# Altium project 111.PrjPCB
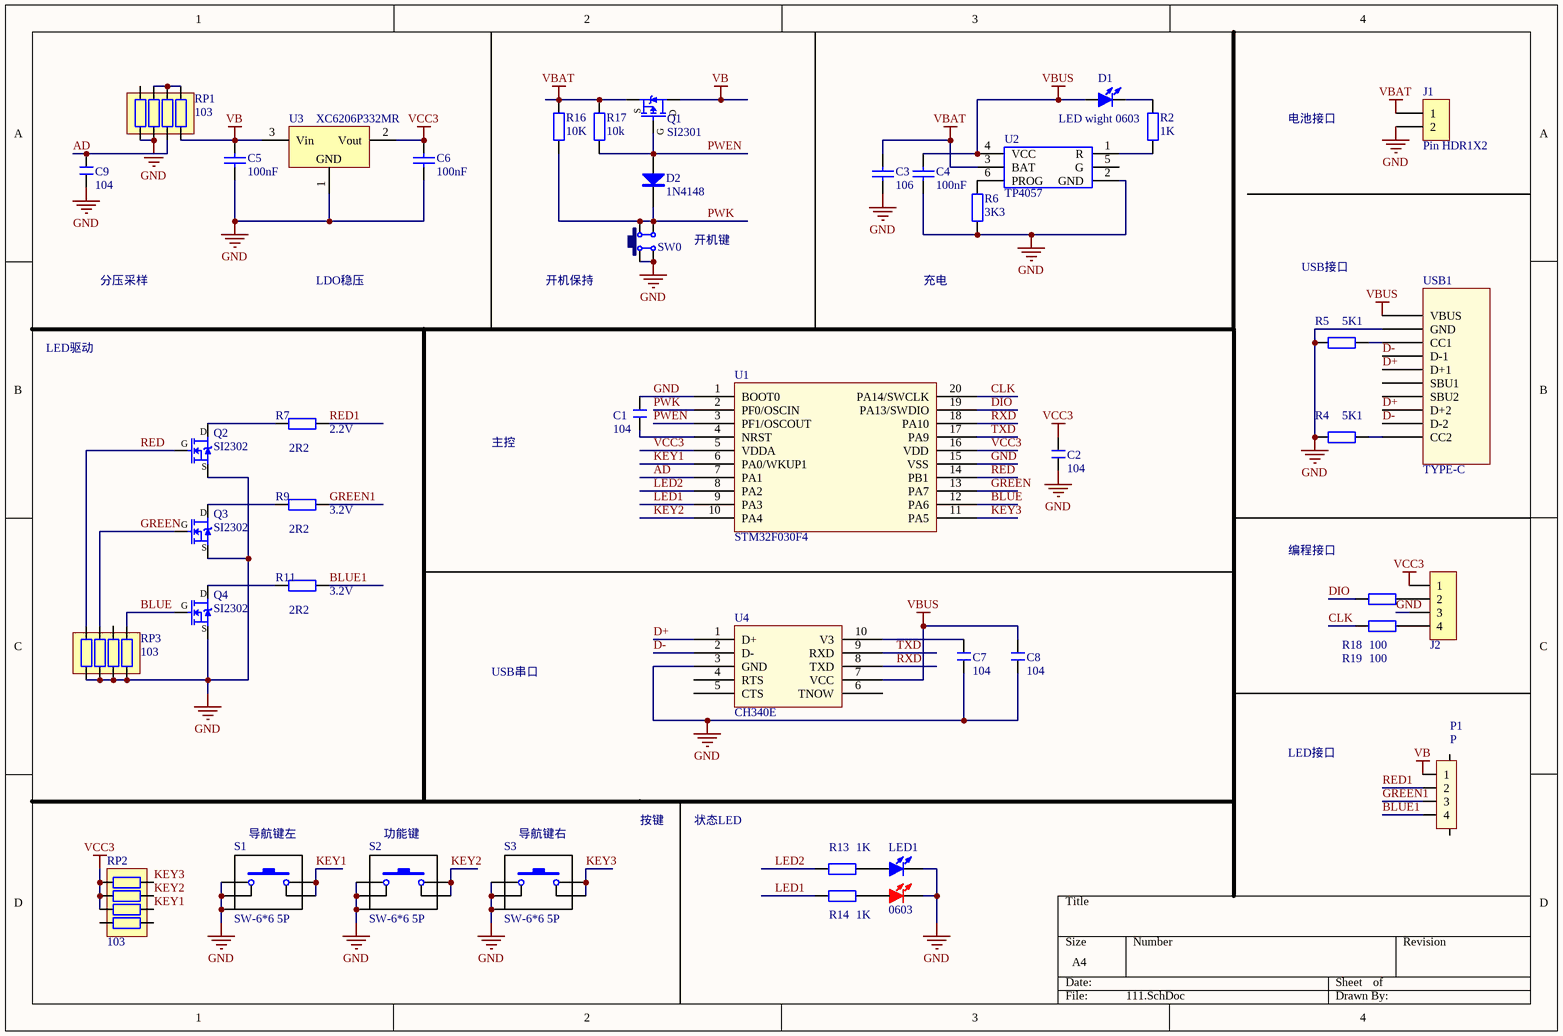
[diagram p0: 111.SchDoc]
1 sheet, 44 parts. Net scope: global (net labels, ports and power ports of the same name join across sheets).
Board file: 111.PcbDoc

## Sheet 111.SchDoc
size A4

### Parts
C1  104  [C 0402_M]
C2  104  [C 0402_M]
C3  value 106  [C-RAD-0805]  (hidden comment: Cap)
C4  value 100nF  [C-RAD-0603]  (hidden comment: Cap)
C5  value 100nF  [C-RAD-0603]  (hidden comment: Cap)
C6  value 100nF  [C-RAD-0603]  (hidden comment: Cap)
C7  104  [C 0402_M]
C8  104  [C 0402_M]
C9  104  [C 0402_M]
D1  LED wight 0603  [LED 0603R]
D2  1N4148  [SOD-323]
J1  Pin HDR1X2  [SH1.0_2pin]
J2  HDR-1X4  [HDR2.0-LI-4P]  (value not drawn)
LED1  0603  [LED 0603-RG]
P1  P  [SH1.0_4pin]
Q1  SI2301  [SOT23-3N]
Q2  SI2302  [SOT23-3N]
Q3  SI2302  [SOT23-3N]
Q4  SI2302  [SOT23-3N]
R2  1K  [R 0402_M]
R4  5K1  [R 0402_M]
R5  5K1  [R 0402_M]
R6  3K3  [R 0402_M]
R7  2R2  [0603-1]
R9  2R2  [0603-1]
R11  2R2  [0603-1]
R13  1K  [R 0402_M]
R14  1K  [R 0402_M]
R16  10K  [R 0402_M]
R17  10k  [R 0402_M]
R18  100  [R 0402_M]
R19  100  [R 0402_M]
RP1  103  [RCA-8P4R-0402]
RP2  103  [RCA-8P4R-0402]
RP3  103  [RCA-8P4R-0402]
S1  SW-6*6 5P  [BUTTON-5Pin]
S2  SW-6*6 5P  [BUTTON-5Pin]
S3  SW-6*6 5P  [BUTTON-5Pin]
SW0  4x4x0.8  [TS-027A]  (value not drawn)
U1  STM32F030F4  [TSSOP20]
U2  TP4057  [SOT23-6]
U3  XC6206P332MR  [SOT23-3N]
U4  CH340E  [MSOP10_M]
USB1  TYPE-C  [TYPE-C]

### Nets
GND: C1.2 C2.2 C3.1 C4.1 C5.1 C6.1 C7.1 C8.1 C9.1 J1.2 J2.3 LED1.3 LED1.4 Q2.2(S) Q3.2(S) Q4.2(S) R4.2 R5.2 R6.1 RP1.1 RP1.2 RP3.1 RP3.2 RP3.3 RP3.4 S1.1 S1.4 S1.5 S2.1 S2.4 S2.5 S3.1 S3.4 S3.5 SW0.1 SW0.4 U1.1(BOOT0) U1.15(VSS) U2.2(GND) U3.1(GND) U4.3(GND) USB1.GND
VB: C5.2 P1.1 Q1.3(D) RP1.4 U3.3(Vin)
VBAT: C3.2 J1.1 Q1.2(S) R16.2 R17.2 U2.3(BAT)
VBUS: C4.2 C8.2 D1.1(A) U2.4(VCC) U4.7(VCC) USB1.VBUS
VCC3: C2.1 C6.2 J2.1 RP2.5 RP2.6 RP2.7 U1.5(VDDA) U1.16(VDD) U3.2(Vout)
AD: C9.2 RP1.3 U1.7(PA1)
BLUE: Q4.1(G) RP3.5 U1.12(PA6)
BLUE1: P1.4 R11.2
CLK: R19.2 U1.20(PA14/SWCLK)
D+: U4.1(D+) USB1.D+1 USB1.D+2
D-: U4.2(D-) USB1.D-1 USB1.D-2
DIO: R18.2 U1.19(PA13/SWDIO)
GREEN: Q3.1(G) RP3.7 U1.13(PA7)
GREEN1: P1.3 R9.2
KEY1: RP2.2 S1.2 S1.3 U1.6(PA0/WKUP1)
KEY2: RP2.3 S2.2 S2.3 U1.10(PA4)
KEY3: RP2.4 S3.2 S3.3 U1.11(PA5)
LED1: R14.1 U1.9(PA3)
LED2: R13.1 U1.8(PA2)
PWEN: D2.A Q1.1(G) R17.1 U1.3(PF1/OSCOUT)
PWK: D2.K R16.1 SW0.2 SW0.3 U1.2(PF0/OSCIN)
RED: Q2.1(G) RP3.8 U1.14(PB1)
RED1: P1.2 R7.2
RXD: U1.18(PA10) U4.8(TXD)
TXD: U1.17(PA9) U4.9(RXD)
NetC1_1: C1.1 U1.4(NRST)
NetC7_2: C7.2 U4.10(V3)
NetD1_2: D1.2(K) R2.2
NetJ2_2: J2.2 R18.1
NetJ2_4: J2.4 R19.1
NetLED1_1: LED1.1 R13.2
NetLED1_2: LED1.2 R14.2
NetQ2_3: Q2.3(D) R7.1
NetQ3_3: Q3.3(D) R9.1
NetQ4_3: Q4.3(D) R11.1
NetR2_1: R2.1 U2.1(R)
NetR4_1: R4.1 USB1.CC2
NetR5_1: R5.1 USB1.CC1
NetR6_2: R6.2 U2.6(PROG)
NetRP1_5: RP1.5 RP1.6 RP1.7

Not connected (* = marked no-connect by the designer): P1 0; RP1 8; RP2 1 8; RP3 6; U2 5(G); U4 4(RTS) 5(CTS) 6(TNOW); USB1 SBU1 SBU2

### Notes on the sheet
- 电池接口
- 开机键
- 分压采样
- LDO稳压
- 开机保持
- 充电
- USB接口
- LED驱动
- (near R7) 2.2V
- 主控
- (near R9) 3.2V
- 编程接口
- (near R11) 3.2V
- USB串口
- LED接口
- (near S1) 导航键左
- (near S2) 功能键
- (near S3) 导航键右
- 按键
- 状态LED

### Library data of the parts
C1 C2 C7-C9 = C: 无极性贴片电容; 版权归属: 源创客; 材质: X7R; BOM名称: 无极性贴片电容; 学习资源: www.ooocke.com
C3-C6 = Cap: 无极性电容; Published: 8-Jun-2000; LatestRevisionDate: 17-Jul-2002; LatestRevisionNote: Re-released for DXP Platform.; PackageReference: RAD-0.3; Publisher: Altium Limited
D1 = LED-SMD: 贴片LED; 版权归属: 源创客; BOM名称: 贴片LED; 学习资源: www.ooocke.com
D2 = 1N4148: 高速开关二极管; 版权归属: 源创客; BOM名称: 高速开关二极管; 学习资源: www.ooocke.com
J2 = Header 4: 4P接插件; 版权归属: 源创客; BOM名称: 4P接插件; 学习资源: www.ooocke.com
LED1 = LED-SMD-RG: 贴片双色LED; 版权归属: 源创客; BOM名称: 贴片双色LED; 学习资源: www.ooocke.com
P1 = SH1.0-4
Q1 = SI2301: P沟道 20V/2.8A; BOM名称: 场效应管; 版权归属: 源创客; 学习资源: www.ooocke.com; 描述: P沟道 20V/2.8A
Q2-Q4 = SI2302: N沟道 20V/3A; BOM名称: 场效应管; 版权归属: 源创客; 学习资源: www.ooocke.com; 描述: N沟道 20V/3A
R2 R4-R6 R13 R14 R16-R19 = R: 贴片电阻; 版权归属: 源创客; BOM名称: 贴片电阻; 学习资源: www.ooocke.com
R7 R9 R11 = Res1: 贴片电阻; Published: 8-Jun-2000; LatestRevisionDate: 17-Jul-2002; LatestRevisionNote: Re-released for DXP Platform.; PackageReference: AXIAL-0.4; Publisher: Altium Limited
RP1-RP3 = R-8P4R: 贴片网络排阻; 版权归属: 源创客; BOM名称: 贴片网络排阻; 学习资源: www.ooocke.com
S1-S3 = SW-6*6 5P: 微动开关; Published: 24-Mar-1999; LatestRevisionDate: 17-Jul-2002; LatestRevisionNote: Re-released for DXP Platform.; PackageReference: SPST-2; Publisher: Altium Limited
SW0 = TS-027A: 薄膜轻触开关; 版权归属: 源创客; BOM名称: 薄膜轻触开关; 学习资源: www.ooocke.com
U3 = XC6206P332MR: 低压差线性稳压芯片; 版权归属: 源创客; BOM名称: 低压差线性稳压芯片; 学习资源: www.ooocke.com
USB1 = USB-C